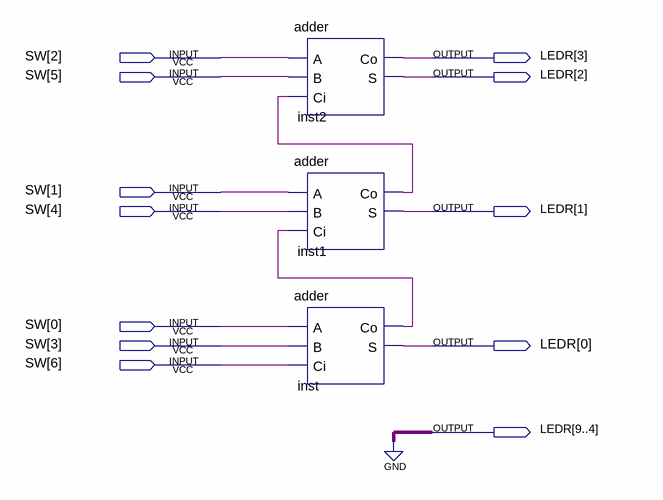
[diagram p0: schematic sheet]
// Quartus schematic part_b.bdf as structural Verilog: 3 symbols, 12 pins
module part_b (
  input  [6:0] SW,
  output [9:0] LEDR
);

  wire inst1_co, inst_co;

  adder inst2 (.A(SW[2]), .B(SW[5]), .Ci(inst1_co), .Co(LEDR[3]), .S(LEDR[2]));
  adder inst1 (.A(SW[1]), .B(SW[4]), .Ci(inst_co), .Co(inst1_co), .S(LEDR[1]));
  adder inst (.A(SW[0]), .B(SW[3]), .Ci(SW[6]), .Co(inst_co), .S(LEDR[0]));

  assign LEDR[9:4] = {6{1'b0}};
endmodule
